# EAGLE design CANBedDualGd (EAGLE 6.4)
DESCRIPTION: microOBD 200 OBD-II Module; HW_REV: 1.4; PCB_REV: C; PCB_SPEC1: Layer Count: 4; PCB_SPEC2: Size: 1.3" x 0.59"; PCB_SPEC3: Finish Thickness: 0.049" - 0.052"; PCB_SPEC4: Copper Weight: 1oz; TITLE: STM1120

## Sheet 1 of 2
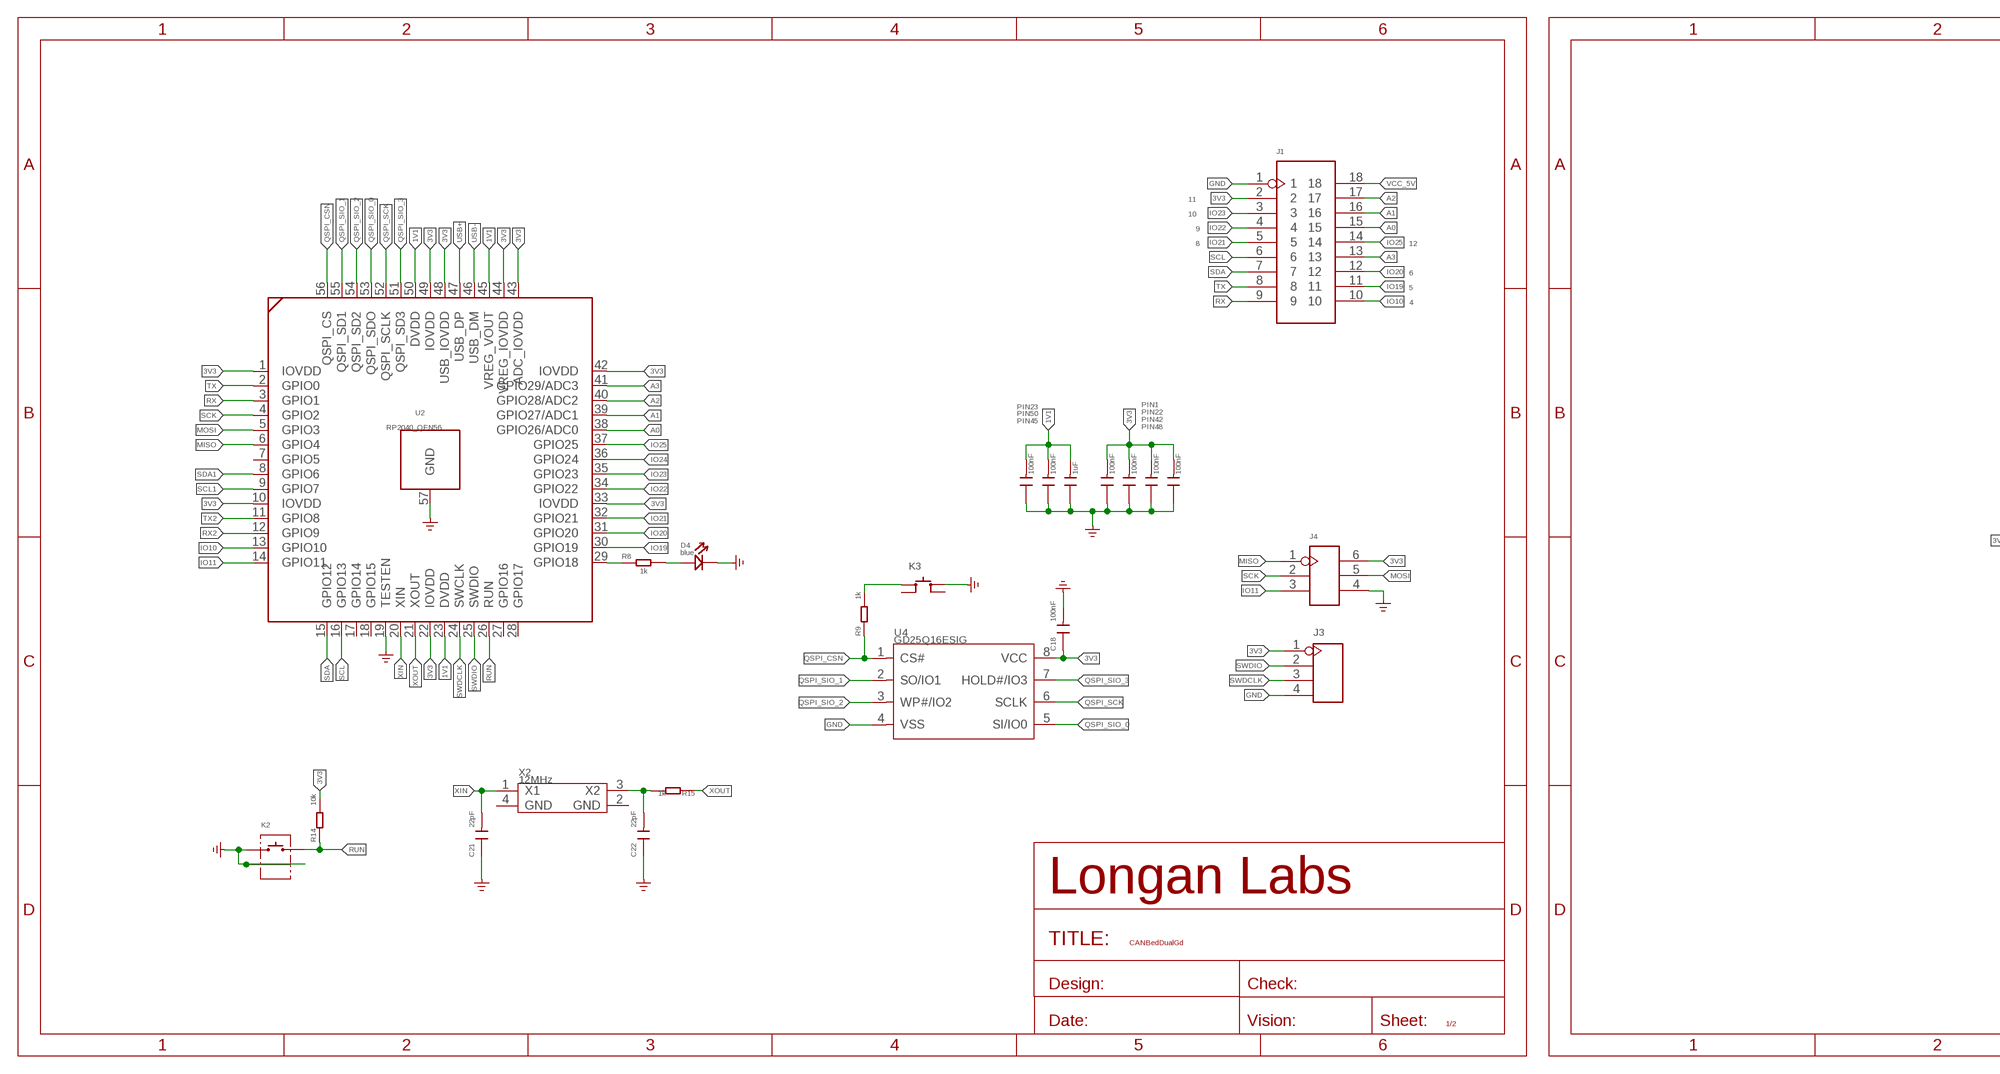
[diagram p0: schematic, sheet 1, part 1 of 2]
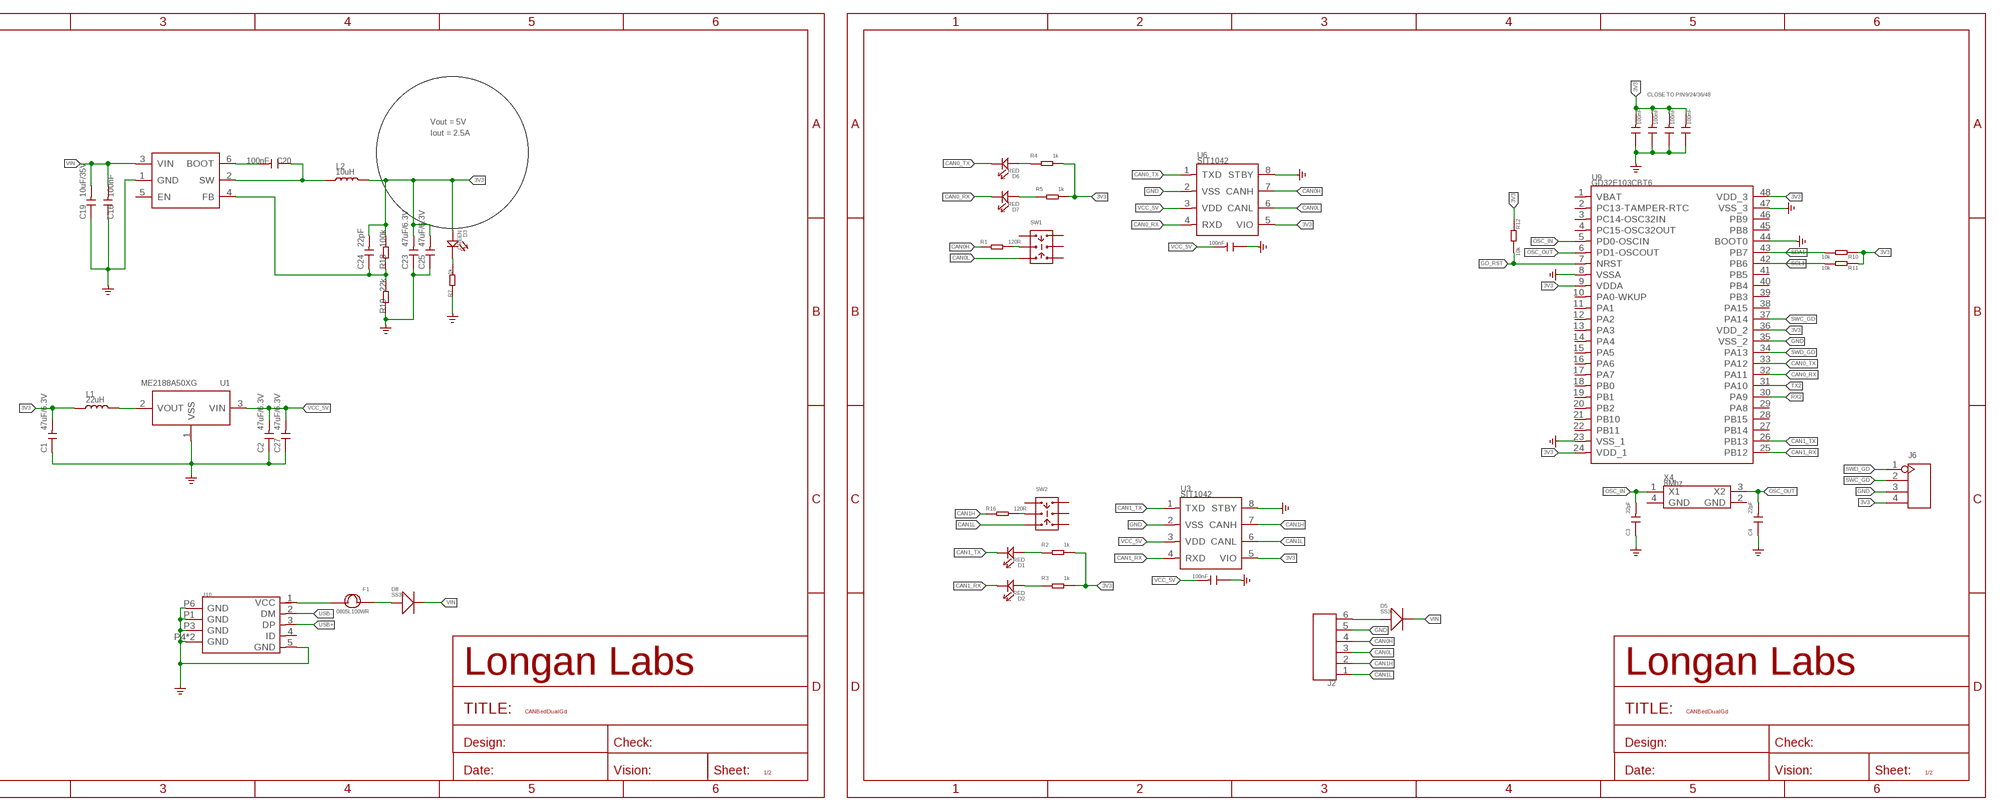
[diagram p1: schematic, sheet 1, part 2 of 2]

### Parts
C1  47uF/6.3V  CAP-0805  [C0805]
C2  47uF/6.3V  CAP-0805  [C0805]
C3  22pF  CAP-0603  [C0603]
C4  22pF  CAP-0603  [C0603]
C5  100nF  CAP-0603  [C0603]
C6  100nF  CAP-0603  [C0603]
C7  100nF  CAP-0603  [C0603]
C8  100nF  CAP-0603  [C0603]
C9  100nF  CAP-0603  [C0603]
C10  100nF  CAP-0603  [C0603]
C11  1uF  CAP-0603  [C0603]
C12  100nF  CAP-0603  [C0603]
C13  100nF  CAP-0603  [C0603]
C14  100nF  CAP-0603  [C0603]
C15  100nF  CAP-0603  [C0603]
C16  100nF  CAP-0603  [C0603]
C17  100nF  CAP-0603  [C0603]
C18  100nF  CAP-0603  [C0603]
C19  10uF/35V  CAP-1206  [C1206]
C20  100nF  CAP-0603  [C0603]
C21  22pF  CAP-0603  [C0603]
C22  22pF  CAP-0603  [C0603]
C23  47uF/6.3V  CAP-0805  [C0805]
C24  22pF  CAP-0603  [C0603]
C25  47uF/6.3V  CAP-0805  [C0805]
C26  100nF  CAP-0603  [C0603]
C27  47uF/6.3V  CAP-0805  [C0805]
D1  RED  LED'0603'  [LED-0603]
D2  RED  LED'0603'  [LED-0603]
D3  GREEN  LED'0603'  [LED-0603]
D4  blue  LED'0603'  [LED-0603]
D5  SS32  DIODE'SMA'  [DO-214AC]
D6  RED  LED'0603'  [LED-0603]
D7  RED  LED'0603'  [LED-0603]
D8  SS32  DIODE'SMA'  [DO-214AC]
F1  0805L100WR  FUSE0805  [F0805]
J1  HEADER-2X9P-2.54  [H2X9-2.54]
J2  SCREW-TERMINAL-6P-3.5  [H6-3.5-21.7X7.0MM]
J3  HEADER-4P-SMD  [H4-SMD-2.54]
J4  HEADER-2X3P-2.54  [H2X3-2.54]
J6  HEADER-4P-SMD  [H4-SMD-2.54]
J10  MICRO-USB5+4P-320010050  [MICRO-USB5+5P-SMD-0.65-7.2X5.06MM]
K2  BUTTON-2+2P  [SW2+2P-7.7X2.75X3.95MM]
K3  BUTTON-4P-4.5X4.5X3.3MM  [SW4-4.5X4.5X3.3MM]
L1  22uH  INDUCTOR-3030  [L3030-TAIYO-YUDEN-NR3012]
L2  10uH  INDUCTOR-SPD3D16-4R7M  [L0420]
R1  120R  RES-0603  [R0603]
R2  1k  RES-0603  [R0603]
R3  1k  RES-0603  [R0603]
R4  1k  RES-0603  [R0603]
R5  1k  RES-0603  [R0603]
R7  1k  RES-0603  [R0603]
R8  1k  RES-0603  [R0603]
R9  1k  RES-0603  [R0603]
R10  10k  RES-0603  [R0603]
R11  10k  RES-0603  [R0603]
R12  10k  RES-0603  [R0603]
R14  10k  RES-0603  [R0603]
R15  1k  RES-0603  [R0603]
R16  120R  RES-0603  [R0603]
R18  100k  RES-0603  [R0603]
R19  22k  RES-0603  [R0603]
SW1  SWITCH-2CH-6P-311010004  [SW6-2.54-9.0X3.5X3.2+2.0MM]
SW2  SWITCH-2CH-6P-311010004  [SW6-2.54-9.0X3.5X3.2+2.0MM]
U1  ME2188A50XG  PMIC-XC6206PMR  [SOT-23]
U2  RP2040_QFN56  [RP2040_QFN56]
U3  SIT1042  TRANSCEIVER-MCP2542  [SOIC8-1.27-5X4MM]
U4  GD25Q16ESIG  FLASH-GD25Q16E  [SOP8-1.27-5.3X5.25X2MM]
U5  PMIC-TPS54302  [SOT-23-6]
U6  SIT1042  TRANSCEIVER-MCP2542  [SOIC8-1.27-5X4MM]
U9  GD32E103CBT6  MCU-GD32E103CBT6  [LQFP48]
X2  12MHz  CRYSTAL-4P-3225  [X4-SMD-3.2X2.5X0.7MM]
X4  8Mhz  CRYSTAL-4P-3225  [X4-SMD-3.2X2.5X0.7MM]

### Nets
1V1: C9.2 C10.2 C11.2 U2.23(DVDD) U2.45(VREG_VOUT) U2.50(DVDD)
3V3: C1.2 C5.2 C6.2 C7.2 C8.2 C12.2 C13.2 C14.2 C15.2 C18.1 C23.2 C24.2 C25.2 D3.+ J1.2 J3.1 J4.6 J6.4 L1.1 L2.2 R2.2 R3.2 R4.2 R5.2 R10.1 R11.1 R12.1 R14.2 R18.2 U2.1(IOVDD) U2.10(IOVDD) U2.22(IOVDD) U2.33(IOVDD) U2.42(IOVDD) U2.43(ADC_IOVDD) U2.44(VREG_IOVDD) U2.48(USB_IOVDD) U2.49(IOVDD) U3.5(VIO) U4.8(VCC) U6.5(VIO) U9.9(VDDA) U9.24(VDD_1) U9.36(VDD_2) U9.48(VDD_3)
A0: J1.15 U2.38(GPIO26/ADC0)
A1: J1.16 U2.39(GPIO27/ADC1)
A2: J1.17 U2.40(GPIO28/ADC2)
A3: J1.13 U2.41(GPIO29/ADC3)
CAN0_RX: D7.- U6.4(RXD) U9.32(PA11)
CAN0_TX: D6.- U6.1(TXD) U9.33(PA12)
CAN0H: J2.4 R1.1 U6.7(CANH)
CAN0L: J2.3 SW1.CH1B U6.6(CANL)
CAN1_RX: D2.- U3.4(RXD) U9.25(PB12)
CAN1_TX: D1.- U3.1(TXD) U9.26(PB13)
CAN1H: J2.2 R16.1 U3.7(CANH)
CAN1L: J2.1 SW2.CH1B U3.6(CANL)
EXT_PWR: F1.2 J10.1(VCC)
GD_RST: R12.2 U9.7(NRST)
GND: C1.1 C2.1 C3.1 C4.1 C5.1 C6.1 C7.1 C8.1 C9.1 C10.1 C11.1 C12.1 C13.1 C14.1 C15.1 C16.1 C17.1 C18.2 C19.1 C21.1 C22.1 C23.1 C25.1 C26.1 C27.1 D4.- J1.1 J2.5 J3.4 J4.4 J6.3 J10.5(GND) J10.P1(GND) J10.P3(GND) J10.P4(GND) J10.P5(GND) J10.P6(GND) K2.1 K2.S1 K2.S2 K3.3(B0) R7.1 R19.1 U1.1(VSS) U2.19(TESTEN) U2.57(GND) U3.2(VSS) U3.8(STBY) U4.4(VSS) U5.1(GND) U6.2(VSS) U6.8(STBY) U9.8(VSSA) U9.23(VSS_1) U9.35(VSS_2) U9.44(BOOT0) U9.47(VSS_3) ; supply symbol labelled GND_POWER
IO10: J1.10 U2.13(GPIO10)
IO11: J4.3 U2.14(GPIO11)
IO19: J1.11 U2.30(GPIO19)
IO20: J1.12 U2.31(GPIO20)
IO21: J1.5 U2.32(GPIO21)
IO22: J1.4 U2.34(GPIO22)
IO23: J1.3 U2.35(GPIO23)
IO24: U2.36(GPIO24)
IO25: J1.14 U2.37(GPIO25)
MISO: J4.1 U2.6(GPIO4)
MOSI: J4.5 U2.5(GPIO3)
N$1: D3.- R7.2
N$2: D1.+ R2.1
N$3: R8.1 U2.29(GPIO18)
N$4: R1.2 SW1.COM1
N$5: R16.2 SW2.COM1
N$6: D4.+ R8.2
N$7: K3.1(A0) R9.2
N$8: C22.2 R15.2 X2.3(X2)
N$9: D6.+ R4.1
N$10: D7.+ R5.1
N$11: D8.1(+) F1.1
N$12: C20.1 L2.1 U5.2(SW)
N$14: C20.2 U5.6(BOOT)
N$15: D2.+ R3.1
N$16: L1.2 U1.2(VOUT)
N$17: D5.1(+) J2.6
N$26: C24.1 R18.1 R19.2 U5.4(FB)
OSC_IN: C3.2 U9.5(PD0-OSCIN) X4.1(X1)
OSC_OUT: C4.2 U9.6(PD1-OSCOUT) X4.3(X2)
QSPI_CSN: R9.1 U2.56(QSPI_CS) U4.1(CS#)
QSPI_SCK: U2.52(QSPI_SCLK) U4.6(SCLK)
QSPI_SIO_0: U2.53(QSPI_SDO) U4.5(SI/IO0)
QSPI_SIO_1: U2.55(QSPI_SD1) U4.2(SO/IO1)
QSPI_SIO_2: U2.54(QSPI_SD2) U4.3(WP#/IO2)
QSPI_SIO_3: U2.51(QSPI_SD3) U4.7(HOLD#/IO3)
RUN: K2.2 R14.1 U2.26(RUN)
RX: J1.9 U2.3(GPIO1)
RX2: U2.12(GPIO9) U9.30(PA9)
SCK: J4.2 U2.4(GPIO2)
SCL: J1.6 U2.16(GPIO13)
SCL1: R11.2 U2.9(GPIO7) U9.42(PB6)
SDA: J1.7 U2.15(GPIO12)
SDA1: R10.2 U2.8(GPIO6) U9.43(PB7)
SWC_GD: J6.2 U9.37(PA14)
SWD_GD: J6.1 U9.34(PA13)
SWDCLK: J3.3 U2.24(SWCLK)
SWDIO: J3.2 U2.25(SWDIO)
TX: J1.8 U2.2(GPIO0)
TX2: U2.11(GPIO8) U9.31(PA10)
USB+: J10.3(DP) U2.47(USB_DP)
USB-: J10.2(DM) U2.46(USB_DM)
VCC_5V: C2.2 C17.2 C26.2 C27.2 J1.18 U1.3(VIN) U3.3(VDD) U6.3(VDD)
VIN: C16.2 C19.2 D5.2(-) D8.2(-) U5.3(VIN)
XIN: C21.2 U2.20(XIN) X2.1(X1)
XOUT: R15.1 U2.21(XOUT)
Unconnected: J10.4(ID) K3.2(A1) K3.4(B1) SW1.CH1A SW1.CH2A SW1.CH2B SW1.COM2 SW2.CH1A SW2.CH2A SW2.CH2B SW2.COM2 U2.7(GPIO5) U2.17(GPIO14) U2.18(GPIO15) U2.27(GPIO16) U2.28(GPIO17) U5.5(EN) U9.1(VBAT) U9.2(PC13-TAMPER-RTC) U9.3(PC14-OSC32IN) U9.4(PC15-OSC32OUT) U9.10(PA0-WKUP) U9.11(PA1) U9.12(PA2) U9.13(PA3) U9.14(PA4) U9.15(PA5) U9.16(PA6) U9.17(PA7) U9.18(PB0) U9.19(PB1) U9.20(PB2) U9.21(PB10) U9.22(PB11) U9.27(PB14) U9.28(PB15) U9.29(PA8) U9.38(PA15) U9.39(PB3) U9.40(PB4) U9.41(PB5) U9.45(PB8) U9.46(PB9) X2.2(GND) X2.4(GND) X4.2(GND) X4.4(GND)

### Notes on the sheet
- CLOSE TO PIN9/24/36/48
- Vout = 5V
- Iout = 2.5A
- 11
- 10
- 9
- 8 | 12
- 6
- 5
- 4
- PIN23
- PIN1
- PIN50
- PIN22
- PIN45
- PIN42
- PIN48

## Sheet 2 of 2

## Library data of the parts
C1-C27 = Discrete-new:CAP: Ceramic Capacitors
D1-D4 D6 D7 = Discrete-new:LED
D5 D8 = Discrete-new:DIODE*
F1 = Discrete-small:FUSE
J1 = Connector-new:HEADER-2X9P
J2 = Connector-new:SCREW-TERMINAL-6P: 320110059
J3 J6 = Connector-new:HEADER-4P
J4 = Connector-new:HEADER-2X3P
J10 = Connector-new:MICRO-USB5+4P: 320010137:MICRO USB B型DIP 沉板0.7无卷边 -ST-USB-01H2 320010000:MICRO USB 5F CCHT 6.45(0.8X0.9) -ST-USB-001G 320010050:USB-MC-001-05 320010025:MICRO USB 5S AB TYPE DIP7.2
K2 = Connector-new:BUTTON-2+2P
K3 = Switch:BUTTON-4P
L1 L2 = Discrete-new:INDUCTOR
R1-R5 R7-R12 R14-R16 R18 R19 = Discrete-new:RES
SW1 SW2 = Switch:SWITCH-2CH-6P
U1 = IC-new:PMIC-XC6206P: LOW ESR Cap.Compatible Positive Voltage Regulators
U2 = RP2040_QFN56:RP2040_QFN56
U3 U6 = untitled:TRANSCEIVER-MCP2542
U4 = Longan-IC:FLASH-GD25Q16E
U5 = IC-new:PMIC-TPS54302
U9 = Longan-IC:MCU-GD32E103CBT6
X2 X4 = Discrete-new:CRYSTAL-4P

## Net classes
3 usbvcc: width 0.152 mm, drill 0.152 mm, clearance 0.152 mm

## Board
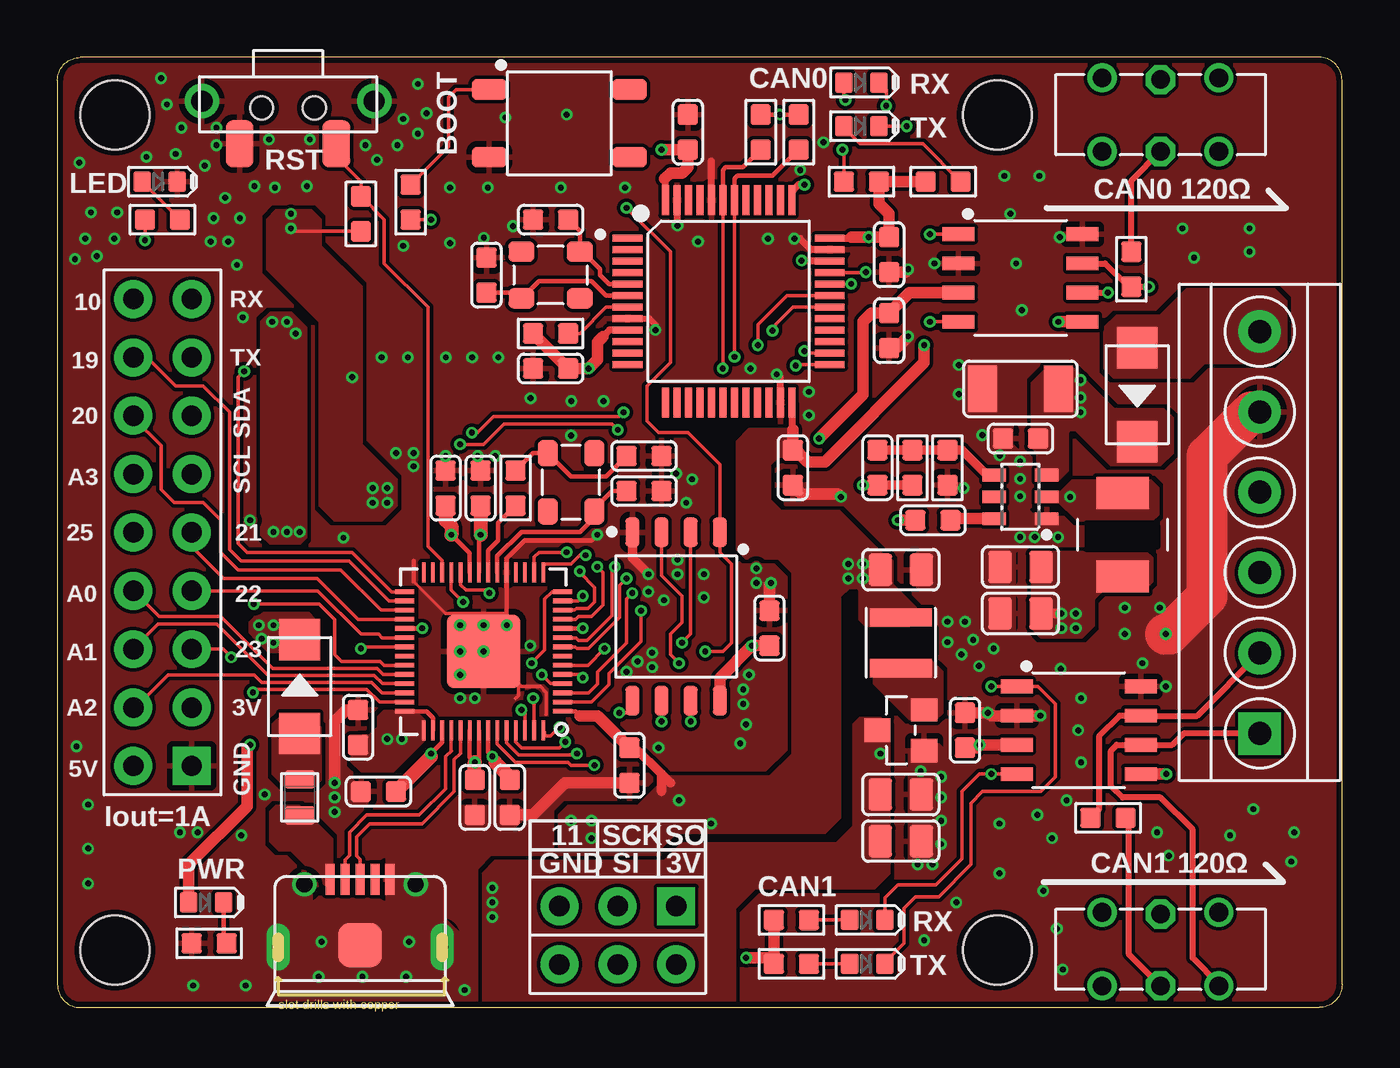
[diagram p2: board, top side]
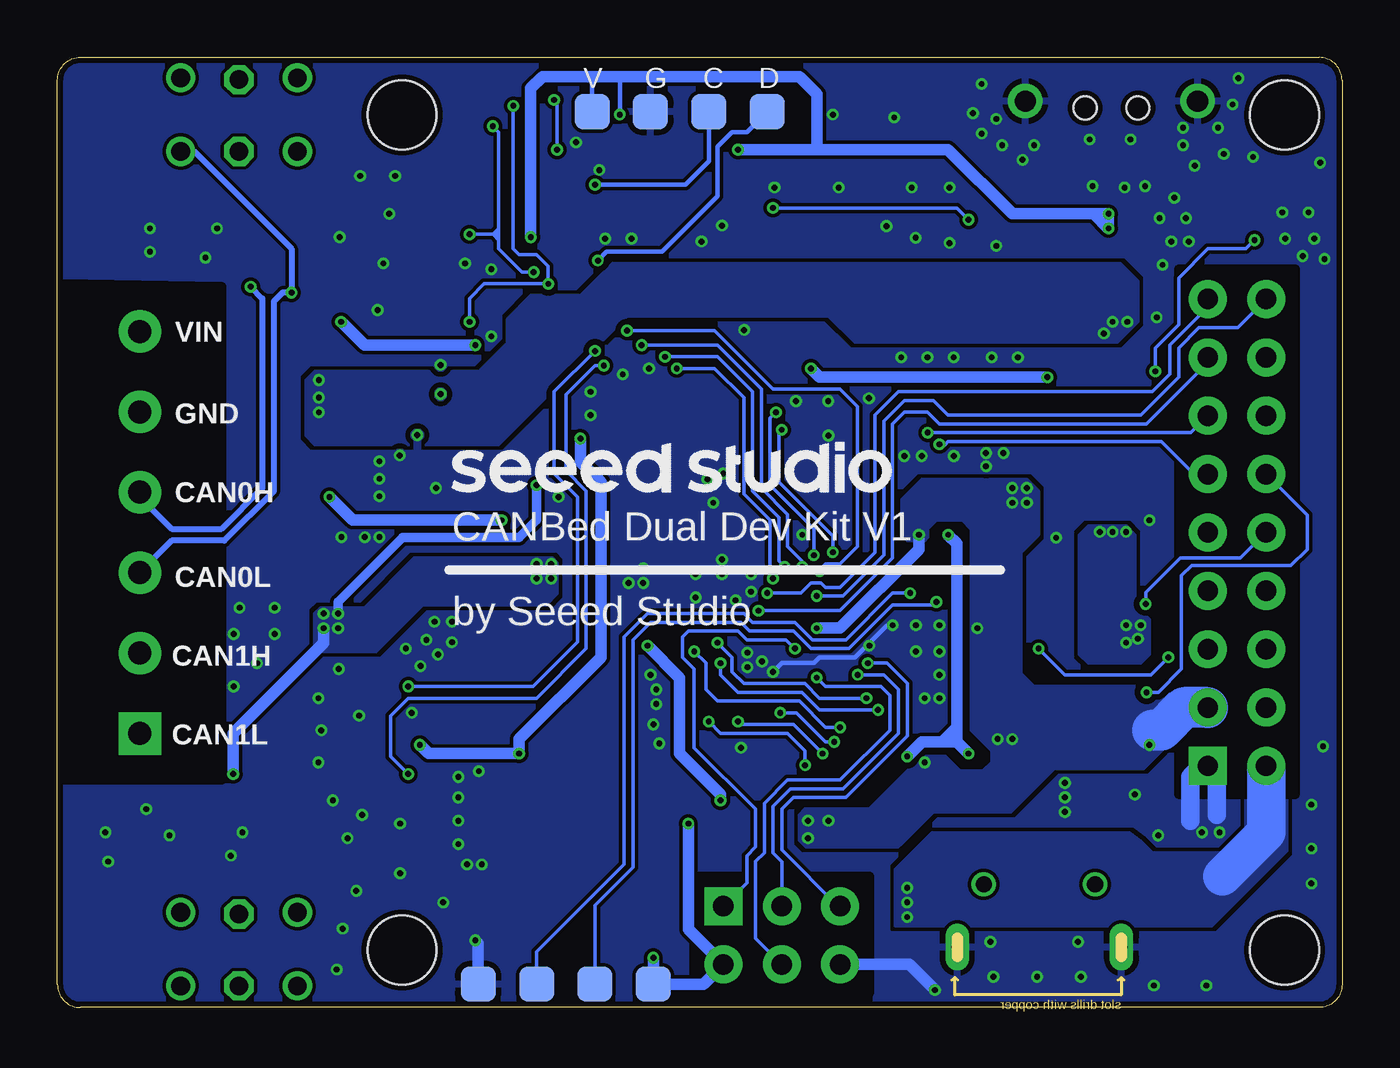
[diagram p3: board, bottom side, seen from below]

Size 55.91 x 41.35 mm. Coordinates in mm from the lower left corner, seen from the top.
Outline: 1,0 54.91,0 arc90 55.91,1 55.91,40.35 arc84 55.01,41.35 1,41.35 arc90 0,40.35 0,1 arc90 1,0
Copper layers (1*16): Top 0.035mm / dielectric 1.5mm / Bottom 0.035mm
Design rules "SeeedStudio_2layer_DRU_no_angle_20140221 *": minimum track width 1mil, minimum drill 10mil, track to track 6mil, track to pad 6mil, pad to pad 6mil, via to via 6mil, smd to smd 0mil, copper to edge 10mil, drill to drill 10mil, minimum pad ring 4mil, minimum via ring 4mil, stop-mask expansion 2mil, vias tented up to drill 25mil, thermal gap 10mil
Holes 3 mm at 2.5,38.85 2.5,2.5 40.91,38.85 40.91,2.5
tRestrict: area 44.8,20.1 to 47.9,21; area 38,15.4 to 38.2,16.5
bRestrict: area 2,9.3 to 7.1,32.1; area 48.8,9.9 to 55.9,31.5; area 20.6,0.6 to 28.2,5.7

### Footprints (pad centres in the part's own frame; a part is rotated, then mirrored left to right if it is on the bottom)
C0805 = smd 1.016 x 1.397: 1 -0.889,0; 2 0.889,0
C0603 = smd 0.889 x 0.889: 1 -0.762,0; 2 0.762,0
C1206 = smd 1.27 x 2.032: 1 -1.651,0; 2 1.651,0
LED-0603 = smd 0.762 x 0.889: + 0.762,0; - -0.762,0
DO-214AC = smd 1.8 x 1.77: 1 -2.042,0; 2 2.042,0
F0805 = smd 0.819 x 1.27: 1 -0.79,0; 2 0.79,0
H2X9-2.54 = drill 0.889 pad 1.651 square: 1 -1.27,10.16 | drill 0.889 pad 1.651: 2 -1.27,7.62; 3 -1.27,5.08; 4 -1.27,2.54; 5 -1.27,0; 6 -1.27,-2.54; 7 -1.27,-5.08; 8 -1.27,-7.62; 9 -1.27,-10.16; 10 1.27,-10.16; 11 1.27,-7.62; 12 1.27,-5.08; 13 1.27,-2.54; 14 1.27,0; 15 1.27,2.54; 16 1.27,5.08; 17 1.27,7.62; 18 1.27,10.16
H6-3.5-21.7X7.0MM = drill 1 pad 1.85 square: 1 -8.75,0 | drill 1 pad 1.85: 2 -5.25,0; 3 -1.75,0; 4 1.75,0; 5 5.25,0; 6 8.75,0
H4-SMD-2.54 = smd 1.524 x 1.524: 1 0,5.08; 2 0,2.54; 3 0,0; 4 0,-2.54
H2X3-2.54 = drill 0.889 pad 1.651 square: 1 -1.27,2.54 | drill 0.889 pad 1.651: 2 -1.27,0; 3 -1.27,-2.54; 4 1.27,-2.54; 5 1.27,0; 6 1.27,2.54
MICRO-USB5+5P-SMD-0.65-7.2X5.06MM = smd 0.4 x 1.35: 1 -1.3,2.875; 2 -0.65,2.875; 3 0,2.875; 4 0.65,2.875; 5 1.3,2.875 | smd 1.9 x 1.9: P1 0,0 | drill 0.508 pad 1.016 long: P3 -3.575,-0.08; P4 3.575,-0.08 | drill 0.7: P5 -2.425,2.65; P6 2.425,2.65
SW2+2P-7.7X2.75X3.95MM = smd 1.2 x 2.032: 1 -2.1,-0.254; 2 2.1,-0.254 | drill 0.924 pad 1.5: S1 -3.75,1.6; S2 3.75,1.6 | hole 1: -1.15,1.3; 1.15,1.3
SW4-4.5X4.5X3.3MM = smd 1.5 x 0.9: 1 -3.05,1.475; 2 3.05,1.475; 3 -3.05,-1.475; 4 3.05,-1.475
L3030-TAIYO-YUDEN-NR3012 = smd 0.8 x 2.7: 1 -1.1,0; 2 1.1,0
L0420 = smd 1.4 x 2.3: 1 -1.815,0; 2 1.815,0
R0603 = smd 0.889 x 0.889: 1 -0.762,0; 2 0.762,0
SW6-2.54-9.0X3.5X3.2+2.0MM = drill 0.813 pad 1.27: CH1A -2.54,-1.6; CH1B 2.54,-1.6; CH2A -2.54,1.6; CH2B 2.54,1.6 | drill 0.813 pad 1.27 octagon: COM1 0,-1.6; COM2 0,1.524
SOT-23 = smd 1.016 x 1.143: 1 -0.889,-1.016; 2 0.889,-1.016; 3 0,1.016
RP2040_QFN56 = smd 0.875 x 0.2: 1 -3.438,2.6; 2 -3.438,2.2; 3 -3.438,1.8; 4 -3.438,1.4; 5 -3.438,1; 6 -3.438,0.6; 7 -3.438,0.2; 8 -3.438,-0.2; 9 -3.438,-0.6; 10 -3.438,-1; 11 -3.438,-1.4; 12 -3.438,-1.8; 13 -3.438,-2.2; 14 -3.438,-2.6; 29 3.438,-2.6; 30 3.438,-2.2; 31 3.438,-1.8; 32 3.438,-1.4; 33 3.438,-1; 34 3.438,-0.6; 35 3.438,-0.2; 36 3.438,0.2; 37 3.438,0.6; 38 3.438,1; 39 3.438,1.4; 40 3.438,1.8; 41 3.438,2.2; 42 3.438,2.6 | smd 0.2 x 0.875: 15 -2.6,-3.438; 16 -2.2,-3.438; 17 -1.8,-3.438; 18 -1.4,-3.438; 19 -1,-3.438; 20 -0.6,-3.438; 21 -0.2,-3.438; 22 0.2,-3.438; 23 0.6,-3.438; 24 1,-3.438; 25 1.4,-3.438; 26 1.8,-3.438; 27 2.2,-3.438; 28 2.6,-3.438; 43 2.6,3.438; 44 2.2,3.438; 45 1.8,3.438; 46 1.4,3.438; 47 1,3.438; 48 0.6,3.438; 49 0.2,3.438; 50 -0.2,3.438; 51 -0.6,3.438; 52 -1,3.438; 53 -1.4,3.438; 54 -1.8,3.438; 55 -2.2,3.438; 56 -2.6,3.438 | smd 3.2 x 3.2: 57 0,0
SOIC8-1.27-5X4MM = smd 0.6 x 1.4: 1 -1.905,-2.7; 2 -0.635,-2.7; 3 0.635,-2.7; 4 1.905,-2.7; 5 1.905,2.7; 6 0.635,2.7; 7 -0.635,2.7; 8 -1.905,2.7
SOP8-1.27-5.3X5.25X2MM = smd 0.6 x 1.27: 1 -1.905,-3.665; 2 -0.635,-3.665; 3 0.635,-3.665; 4 1.905,-3.665; 5 1.905,3.665; 6 0.635,3.665; 7 -0.635,3.665; 8 -1.905,3.665
SOT-23-6 = smd 0.55 x 1.016: 1 -0.95,-1.143; 2 0,-1.143; 3 0.95,-1.143; 4 0.95,1.143; 5 0,1.143; 6 -0.95,1.143
LQFP48 = smd 1.3 x 0.3: 1 -4.4,2.75; 2 -4.4,2.25; 3 -4.4,1.75; 4 -4.4,1.25; 5 -4.4,0.75; 6 -4.4,0.25; 7 -4.4,-0.25; 8 -4.4,-0.75; 9 -4.4,-1.25; 10 -4.4,-1.75; 11 -4.4,-2.25; 12 -4.4,-2.75; 25 4.4,-2.75; 26 4.4,-2.25; 27 4.4,-1.75; 28 4.4,-1.25; 29 4.4,-0.75; 30 4.4,-0.25; 31 4.4,0.25; 32 4.4,0.75; 33 4.4,1.25; 34 4.4,1.75; 35 4.4,2.25; 36 4.4,2.75 | smd 0.3 x 1.3: 13 -2.75,-4.4; 14 -2.25,-4.4; 15 -1.75,-4.4; 16 -1.25,-4.4; 17 -0.75,-4.4; 18 -0.25,-4.4; 19 0.25,-4.4; 20 0.75,-4.4; 21 1.25,-4.4; 22 1.75,-4.4; 23 2.25,-4.4; 24 2.75,-4.4; 37 2.75,4.4; 38 2.25,4.4; 39 1.75,4.4; 40 1.25,4.4; 41 0.75,4.4; 42 0.25,4.4; 43 -0.25,4.4; 44 -0.75,4.4; 45 -1.25,4.4; 46 -1.75,4.4; 47 -2.25,4.4; 48 -2.75,4.4
X4-SMD-3.2X2.5X0.7MM = smd 1.143 x 0.889: 1 -1.27,-1.016; 2 1.27,-1.016; 3 1.27,1.016; 4 -1.27,1.016

### Placement (x,y rotation side)
C1  36.7,19.05 180 top
C2  36.7,9.27 180 top
C3  21.46,34.29 0 top
C4  18.67,31.88 270 top
C5  21.46,27.81 0 top
C6  32,23.5 90 top
C7  36.2,32.77 90 top
C8  27.43,38.1 270 top
C9  16.89,22.61 270 top
C10  19.68,9.14 90 top
C11  13.97,9.4 0 top
C12  24.89,10.54 90 top
C13  18.41,22.61 270 top
C14  13.08,12.19 270 top
C15  18.16,9.14 90 top
C16  41.91,24.77 0 top
C17  36.2,29.46 90 top
C18  30.99,16.51 90 top
C19  41.91,26.92 0 top
C20  38.1,21.21 0 top
C21  25.53,22.48 180 top
C22  25.53,24 180 top
C23  41.91,19.18 0 top
C24  35.69,23.5 270 top
C25  41.91,17.14 0 top
C26  39.5,12.06 270 top
C27  36.7,7.24 180 top
D1  35.24,1.91 180 top
D2  35.24,3.81 180 top
D3  6.48,4.57 180 top
D4  4.45,35.94 180 top
D5  46.99,26.67 270 top
D6  34.99,38.35 180 top
D7  34.99,40.26 180 top
D8  10.54,13.97 90 top
F1  10.54,9.14 270 top
J1  4.57,20.68 180 top
J2  52.32,20.68 90 top
J3  35.05,1.02 270 bottom
J4  24.38,3.14 270 top
J6  30.1,38.99 270 bottom
J10  13.17,2.71 0 top
K2  10.03,37.85 0 top
K3  21.84,38.48 0 top
L1  36.7,15.88 270 top
L2  46.35,20.57 270 top
R1  46.74,32.13 90 top
R2  31.94,1.91 180 top
R3  31.94,3.81 180 top
R4  38.54,35.94 180 top
R5  34.99,35.94 0 top
R7  6.6,2.79 0 top
R8  4.57,34.29 0 top
R9  15.37,35.05 90 top
R10  30.61,38.1 270 top
R11  32.26,38.1 270 top
R12  21.46,29.34 0 top
R14  13.21,34.54 270 top
R15  19.94,22.61 90 top
R16  45.72,8.26 0 top
R18  37.21,23.5 270 top
R19  38.73,23.5 90 top
SW1  48.01,38.86 0 top
SW2  48.01,2.54 0 top
U1  36.7,12.06 90 top
U2  18.54,15.49 180 top
U3  44.45,12.06 270 top
U4  26.92,17.02 180 top
U5  41.91,22.23 90 top
U6  41.91,31.75 270 top
U9  29.21,30.73 0 top
U$23  [LOGO-SEEED-NEW-2_1X19.1MM]  38.73,22.48 0 bottom
X2  22.35,22.86 90 top
X4  21.46,31.88 180 top

### Tracks (layer width: path | path; a pad name or v marks a point on that pad's centre or on a via)
1V1  (via drill 0.25 pad 0.51)
  Top 0.203: U2.23 17.94,19.78 v17.14,20.57 | U2.45 16.74,11.54 v16.26,11.05 16.26,10.92 | U2.50 18.74,11.1 v18.92,10.92 18.92,10.79 19.05,10.67
  Top 0.61: C9.2 16.89,21.21 17.14,20.95 v17.14,20.57 | C10.2 19.68,10.03 19.05,10.67 | 16.26,10.92 C11.2
  Bottom 0.508: v16.26,11.05 16.76,11.56 | 16.76,11.56 17.4,11.56 | 17.4,11.56 18.29,11.56 v18.92,10.92 | 16.76,11.56 16.76,12.19 | 16.76,12.19 16.76,20.19 v17.14,20.57 | 16.76,12.19 17.4,11.56
3V3  (via drill 0.25 pad 0.51)
  Top 0.152: R14.2 10.29,33.78 v10.16,33.91
  Top 0.203: U2.33 15.86,16.49 v15.88,16.51 | U2.22 18.34,20.5 v18.41,20.57 | U2.44 16.34,12.61 16.06,12.89 U2.42 | U2.48 17.94,10.89 v18.16,10.67 18.34,10.85 U2.49 | U2.1 22.54,12.89 22.73,12.7 | U2.10 22.84,16.49 v22.86,16.51 | R10.1 v31.43,38.86 R11.1
  Top 0.305: U9.9 24.02,29.48 23.75,29.21 | U9.48 26.46,36.02 26.42,36.07 | U9.36 34.5,33.48 34.54,33.53 | U9.24 31.96,25.19 32,25.15
  Top 0.406: 26.67,9.78 26.29,10.16 | 26.29,10.16 25.15,11.3 C12.2 | R18.2 C24.2 v35.05,22.73 | C25.2 v43.69,17.14 | 26.29,10.16 26.29,9.4
  Top 0.508: R3.2 R2.2 30.92,2.16 v29.97,2.16 | 22.73,12.7 23.5,12.7 C12.2 | C18.1 v30.23,15.75 28.83,14.35 U4.8 | R4.2 R5.2 35.75,34.99 36.2,34.54 C7.2 v35.31,33.53 34.54,33.53 | 23.75,29.21 23.5,28.96 23.5,28.19 v23.11,27.81 C5.2 R12.1 | v26.29,37.34 C8.2 27.43,36.58 27.18,36.32 26.67,36.32 26.42,36.07 | 32,25.15 32,24.38 | 32,24.38 C6.2 | D3.+ 5.71,6.22 8.26,8.76 8.26,11.3 v8.38,11.43 | 32,24.38 32.64,23.75 33.4,23.75 37.72,28.07 v37.72,28.83 | U6.5 v43.56,29.84 | U3.5 v48.26,10.16
  Top 0.61: C13.2 v18.41,20.57 | C15.2 v18.16,10.67
  Bottom 0.203: v31.43,38.86 31.43,40.51 | J6.4 32.64,40.39 32.77,40.51
  Bottom 0.406: v35.05,22.73 35.05,21.21 35.81,20.45 40.89,20.45 43.69,17.65 v43.69,17.14
  Bottom 0.508: v28.45,8 28.45,3.4 J4.6 27.78,1.02 J3.1 v29.97,2.16 | v30.23,15.75 28.83,14.35 28.83,11.05 27.05,9.27 v27.05,9.02 | v18.41,20.57 18.41,19.94 21.84,16.51 v22.86,16.51 | v26.29,37.34 22.86,37.34 | 22.86,37.34 17.14,37.34 14.35,34.54 10.79,34.54 | 10.79,34.54 v10.16,34.54 v10.16,33.91 10.79,34.54 | v37.72,28.83 42.55,28.83 v43.56,29.84 | v48.26,10.16 48.26,11.94 44.32,15.88 v44.32,16.51 | v12.83,27.43 22.73,27.43 v23.11,27.81 | v35.31,33.53 35.31,40.01 34.8,40.51 32.77,40.51 31.43,40.51 23.62,40.51 22.86,39.75 22.86,37.34
  Bottom 1.778: J1.2 6.88,13.05 7.87,12.06 8.26,12.06
  other vias: 14.35,11.68 14.99,11.68 22.35,8.13 23.24,8.13 23.24,7.37 14.35,22.61 13.72,22.61 13.72,21.97 14.35,21.97 44.32,17.14 43.69,16.51 35.05,19.3 34.42,19.3 35.05,18.67 34.42,18.67
  pour Top (isolate 0.254, no thermals): 14.61,10.29 13.23,10.29 12.82,10.69 12.82,11.39 13.25,11.81 13.59,11.81 13.97,12.19 13.97,12.64 14.22,12.89 15.56,12.89 15.94,12.51 15.94,11.62
  pour Bottom (isolate 0.254, no thermals): 17.65,21.21 16.53,21.21 16.13,20.81 16.13,12.06 15.24,11.18 15.24,10.67 15.62,10.29 16.64,10.29 17.27,10.92 18.29,10.92 20.57,8.64 23.37,8.64 23.62,8.38 23.62,7.27 23.34,6.99 19.33,6.99 19.18,7.11 17.78,8.51 14.42,8.51 12.51,10.41 8.64,10.41 6.99,12.06 5.46,12.06 5.08,12.45 5.08,13.59 5.46,13.97 13.4,13.97 13.97,14.54 13.97,19.81 13.21,20.57 13.21,22.48 13.72,22.99 18.29,22.99 19.18,22.1 19.18,20.57 18.92,20.32 18.16,20.32 18.03,20.45 18.03,20.83
  pour Top (isolate 0.254, no thermals): 36.2,18.29 36.2,19.43 34.04,21.59 31.5,21.59 30.99,22.1 30.99,23.62 31.37,24 31.88,24 32.13,24.26 32.13,24.77 31.75,25.15 30.1,25.15 29.59,24.64 29.59,19.94 29.97,19.56 31.37,19.56 32,18.92 32,11.02 31.01,10.03 26.54,10.03 25.27,8.76 22.23,8.76 21.84,8.38 21.84,6.99 26.29,6.99 26.92,7.62 33.4,7.62 34.04,8.26 34.04,17.89 34.44,18.29
  pour Top (isolate 0.254, no thermals): 14.73,21.84 14.73,22.99 13.21,24.51 13.21,31.37 11.43,33.15 11.43,34.29 11.05,34.67 9.53,34.67 9.14,34.29 9.14,32.13 11.43,29.84 11.43,21.84 12.06,21.21 14.1,21.21
  pour Top (isolate 0.254, no thermals): 47.37,19.81 42.8,19.81 42.42,19.43 42.42,16.51 42.8,16.13 44.58,16.13 45.09,16.64 45.09,17.78 45.59,18.29 47.37,18.29 47.62,18.54 47.62,19.56
  pour Bottom (isolate 0.254, no thermals): 40.01,17.53 34.65,17.53 34.15,18.02 34.15,19.34 34.37,19.56 40.39,19.56 42.55,17.4 44.45,17.4 44.7,17.14 44.7,15.75 44.45,15.49 42.04,15.49
  pour Top (isolate 0.254, rank 2, no thermals): 37.08,16.64 35.18,16.64 34.92,16.89 34.92,18.16 34.67,18.41 34.67,19.43 34.92,19.68 36.07,19.68 36.32,19.43 36.32,18.41 37.34,17.4 37.34,16.89
A0
  Top 0.152: J1.15 4.42,17.02 7.11,17.02 9.37,14.76 13.92,14.76 14.18,14.49 U2.38
A1
  Top 0.152: J1.16 3.3,15.62 4.38,16.7 6.92,16.7 9.17,14.45 13.79,14.45 14.15,14.09 U2.39
A2
  Top 0.152: J1.17 3.4,13.05 4.83,14.48 8.56,14.48 8.89,14.15 13.66,14.15 14.12,13.69 U2.40
A3  (via drill 0.25 pad 0.51)
  Top 0.152: U2.41 14.01,13.29 13.46,13.84 8.64,13.84 v8.51,13.72
  Bottom 0.152: J1.13 1.52,21.44 1.52,19.94 2.22,19.24 6.54,19.24 6.99,18.8 6.99,14.73 8,13.72 v8.51,13.72
CAN0_RX  (via drill 0.25 pad 0.51)
  Top 0.152: U9.32 34.53,31.48 v34.54,31.5 | U6.4 v37.97,29.84 | v36.07,39.24 36.07,39.94 D7.-
  Bottom 0.152: v36.07,39.24 36.07,33.02 35.81,32.77 35.05,32.77 34.54,32.26 v34.54,31.5 37.34,31.5 37.97,30.86 v37.97,29.84
CAN0_TX  (via drill 0.25 pad 0.51)
  Top 0.152: v36.96,38.35 D6.- | U9.33 35.16,31.98 v35.18,32 | U6.1 v37.97,33.66
  Bottom 0.152: 36.7,33.4 36.7,33.02 35.69,32 v35.18,32 | 36.7,33.4 36.7,33.66 | 36.7,33.66 36.7,33.91 | 36.7,33.91 36.7,38.1 v36.96,38.35 | v37.97,33.66 36.96,33.66 | 36.96,33.66 36.7,33.66 | 36.7,33.91 36.96,33.66 | 36.96,33.66 36.7,33.4
CAN0H  (via drill 0.25 pad 0.51)
  Top 0.254: v47.5,31.37 R1.1 46.61,31.37 45.59,32.38 U6.7
  Bottom 0.254: v47.5,31.37 46.99,30.86 46.99,22.61 48.77,20.83 50.93,20.83 52.32,22.23 J2.4
CAN0L  (via drill 0.25 pad 0.51)
  Top 0.254: U6.6 v45.72,31.11
  Bottom 0.254: J2.3 50.93,20.32 48.64,20.32 46.48,22.48 46.48,30.73 46.1,31.11 v45.72,31.11 45.72,33.02 49.96,37.26 SW1.CH1B
CAN1_RX  (via drill 0.25 pad 0.51)
  Top 0.152: D2.- 36.01,4.76 36.58,5.33 38.23,5.33 39.37,6.48 39.37,9.4 40.13,10.16 v40.64,10.16 U3.4 | U9.25 32.17,27.98 v32.13,27.94
  Bottom 0.152: v32.13,27.94 32.51,27.94 33.78,26.67 33.78,23.37 32.89,22.48 32.89,15.62 35.06,13.46 40.64,13.46 41.4,12.7 41.4,10.92 v40.64,10.16
CAN1_TX  (via drill 0.25 pad 0.51)
  Top 0.152: D1.- 36.01,1.97 36.83,2.79 36.83,4.32 37.34,4.83 38.35,4.83 39.75,6.22 39.75,8.89 40.26,9.4 42.8,9.4 43.43,10.03 43.43,13.21 42.67,13.97 U3.1 v40.64,13.97 | U9.26 32.6,28.48 v32.51,28.57
  Bottom 0.152: v40.64,13.97 35.21,13.97 33.27,15.9 33.27,22.23 34.29,23.24 34.29,26.8 v32.51,28.57
CAN1H
  Top 0.254: R16.1 45.34,8.64 45.34,11.81 46.23,12.7 U3.7 49.6,12.7 J2.2
CAN1L
  Top 0.254: SW2.CH1B 50.55,1.02 49.4,2.16 49.4,7.75 48.01,9.14 46.35,9.14 45.85,9.65 45.85,11.18 46.1,11.43 U3.6 48.51,11.43 49.01,11.93 J2.1
EXT_PWR
  pour Top (isolate 0.254, no thermals): 11.81,5.21 10.16,6.86 9.65,6.86 9.27,7.24 9.27,8.51 9.53,8.76 10.52,8.76 11.94,7.34 11.94,5.33
GD_RST
  Top 0.152: U9.7 23.88,30.48 22.73,29.34 R12.2
GND  (via drill 0.25 pad 0.51)
  Top 0.127: 16.89,17.15 15.49,18.54 | 19.68,16.64 v19.56,16.64
  Top 0.152: 19.54,17.15 16.89,17.15 | 18.54,15.37 18.8,15.37 20.07,14.1 | 20.07,14.1 20.19,13.97 21.02,13.97 21.27,13.72 21.27,12.76 | 20.07,14.1 20.07,13.59 19.94,13.46
  Top 0.203: U2.57 18.54,15.37 19.54,16.37 19.54,17.15 U2.19 19.54,19.54 20.32,20.32 23.24,20.32 v23.5,20.57 | 15.49,18.54 15.49,19.43 | 25.02,20.32 25.08,20.26
  Top 0.254: U9.8 25.77,29.98 26.04,29.72 26.04,29.5 v26.02,29.49
  Top 0.305: U9.47 26.96,34.06 v26.99,34.04 | U9.23 31.46,27.4 v31.3,27.56 | U9.35 32.8,32.98 32.32,33.47 v32.07,33.47 | U9.44 28.46,36.84
  Top 0.406: 25.08,20.26 25.02,20.19 U4.4 25.02,19.56 v25.72,18.86
  Top 0.508: C18.2 30.99,18.41 v31.05,18.48 | C12.1 22.1,9.78 20.7,8.38 C10.1 | C17.1 36.51,28.7 v37.02,29.21 | C7.1 36.89,32 v37.02,32.13 | C6.1 32.38,22.35 33.97,22.35 v34.1,22.23 | C14.1 12.57,12.95 12.06,12.45 v12.06,9.78 | C26.1 v40.49,12.83 40.51,12.83 40.64,12.7 U3.2 v42.77,12.7
  Top 1.778: v48.23,16.26 48.39,16.26 50.04,17.91 50.04,24 51.96,25.93 J2.5
  Bottom 0.152: v19.56,16.64 19.81,16.64
  Bottom 0.203: 19.81,16.64 21.21,15.24 22.73,15.24 22.99,14.99 24.38,14.99 v24.77,14.61
  Bottom 0.508: J4.4 18.83,1.87 v17.72,0.76 | J3.4 37.59,2.79 v37.72,2.92
  Bottom 0.813: 6.6,8.13 6.6,10.03 6.12,10.52 J1.1 5.84,10.16 5.71,10.16 5.46,9.91 5.46,8.38
  other vias: 15.05,38.67 5.4,38.29 5.14,37.15 3.87,37.02 1.46,34.61 1.33,6.92 1.33,5.4 11.49,2.86 15.3,2.86 5.91,0.95 8.19,0.95 26.16,11.3 29.72,11.49 43.5,3.43 43.75,1.65 30.42,18.48 30.42,19.11 30.1,14.48 29.84,13.84 29.84,13.21 15.49,24.13 15.49,23.56 16.89,24 18.29,24 8.57,35.75 18.54,15.49 18.54,16.64 17.53,16.64 17.53,15.49 17.53,14.48 17.53,13.46 18.16,13.46 25.25,15.06 9.46,35.69 1.33,8.83 25.72,18.1 20.57,15.75 26.99,18.86 28.13,17.84 14.8,37.53 13.4,37.53 15.68,38.04 6.92,38.29 6.92,37.53 9.21,37.78 10.99,37.78 14.73,24.13 19.05,24 8.38,21.21 12.45,20.45 6.67,33.34 7.43,33.34 0.95,36.77 2.48,33.46 0.76,32.58 0.83,11.37 26.92,23.24 27.62,22.99 27.37,21.97 22.35,24.89 26.99,19.49 28.13,18.86 16.07,38.93 15.68,40.2 33.34,37.66 29.97,12.32 39.12,4.57 11.37,1.33 13.27,1.33 15.18,1.33 18.55,33.5 19.82,34.01 20.59,26.52 22.36,26.39 23.76,26.39 30.16,27.81 18.73,35.69 21.91,35.69 24.7,35.69 19.49,38.73 22.16,38.86 32.32,36.45 38.16,32.38 43.62,33.53 41.97,30.35 41.72,32.38 41.47,34.54 42.74,36.2 17.08,33.27 15.05,33.15 7.81,32.32 8.06,30.04 19.19,28.3 16.9,28.3 15.25,28.3 14.11,28.3 30.92,33.46 27.88,33.34 38.46,7.11 38.46,8.13 38.46,9.14 38.46,10.03 48.23,13.97 44.55,13.46 43.66,14.73 40.11,14.86 39.85,16 40.74,15.62 39.34,15.37 44.42,12.06 44.55,10.67 43.92,9.02 42.65,8.38 41,8 41,5.84 42.9,5.08 43.28,7.37 51.03,7.49 53.82,7.62 52.04,8.64 53.7,6.35 47.85,7.62 48.36,6.6 47.22,14.99 46.46,16.26 46.46,17.4 47.98,17.4 39.43,22.61 41.9,22.25 41.9,23.01 41.9,23.77 41.01,24.03 39.23,27.97 39.23,26.7 40.25,24.92 39.5,16.79 38.73,16.79 38.73,15.9 32.7,26.8 32.7,25.78 43.55,20.47 42.53,20.47 41.9,20.47 12.06,9.14 12.06,8.51 9.02,9.27 5.33,7.62 6.1,7.62 8,7.49 37.57,10.29 37.44,6.22 38.07,6.22 17.08,35.69 18.05,28.3 41.21,36.2 48.96,33.91 51.88,33.91 51.88,32.89 49.47,32.64 25.88,15.44 25.88,14.81 26.39,17.73 7.3,35.24 7.94,34.35 10.86,35.75 13.91,36.89 6.79,34.35 1.21,33.46 2.6,34.61 1.71,32.7 4.51,40.45 4.76,39.31 6.41,36.64
  pour Top (isolate 0.254, no thermals): 25.91,10.92 30.34,10.92 31.24,11.82 31.24,14.58 30.84,14.99 30.54,14.99 29.97,14.42 29.97,13.01 29.16,12.19 25.91,12.19
  pour Top (isolate 0.127, rank 6): -0.64,41.91 56.52,41.91 56.52,-0.64 -0.64,-0.64
  pour Bottom (isolate 0.127, rank 6): -0.64,41.91 56.52,41.91 56.52,-0.64 2.54,-0.64 2.54,-1.27 -0.64,-1.27
  pour Top (isolate 0.254, no thermals): 20.07,8.76 17.27,8.76 15.88,7.37 14.75,7.37 14.35,6.96 14.35,4.45 13.97,4.06 11.43,4.06 11.05,4.45 11.05,5.21 10.67,5.59 9.14,5.59 8.51,4.95 8.51,2.41 7.75,1.65 7.75,0.51 8.26,0 17.53,0 17.91,0.38 17.91,2.79 16.64,4.06 16.64,4.7 17.14,5.21 20.45,8.38
  pour Top (isolate 0.254, no thermals): 41.15,14.61 39.62,14.61 38.61,15.62 38.61,17.14 37.34,18.41 37.34,19.68 37.72,20.07 40.26,20.07 41.15,20.95 41.15,22.99 39.37,24.77 38.73,24.77 38.23,25.27 38.23,28.07 39.24,29.08 40.89,29.08 41.53,28.45 41.53,24.51 42.16,23.88 42.16,21.72 42.42,21.46 43.43,21.46 44.07,20.83 44.07,20.45 43.94,20.32 42.16,20.32 41.66,19.81 41.66,15.11
  pour Top (isolate 0.254, no thermals): 13.34,9.65 13.08,9.65 12.57,10.16 12.32,10.16 11.94,9.78 11.94,8.38 12.06,8.26 12.83,8.26 13.46,8.89 13.46,9.53
  pour Top (isolate 0.254, no thermals): 38.35,11.43 37.34,11.43 37.08,11.18 37.08,6.22 37.34,5.97 38.23,5.97 38.73,6.48 38.73,11.05
IO10  (via drill 0.25 pad 0.51)
  Top 0.152: U2.13 22.65,17.69 v22.86,17.91
  Bottom 0.152: J1.10 4.55,29.59 6.22,29.59 7.11,28.7 7.11,27.43 8.76,25.78 17.14,25.78 17.78,26.42 19.05,26.42 19.94,25.53 19.94,19.68 21.72,17.91 v22.86,17.91
IO11  (via drill 0.25 pad 0.51)
  Top 0.152: v20.64,14.99 21.21,15.56 21.21,17.78 21.52,18.09 U2.14
  Bottom 0.152: v20.64,14.99 19.81,14.99 18.92,14.1 18.92,11.81 21.59,9.14 23.88,9.14 24.38,8.64 24.38,6.86 21.94,4.41 J4.3
IO19
  Top 0.152: U2.30 14.44,17.69 12.7,19.43 8,19.43 7.49,19.94 7.49,25.91 6.35,27.05 5.14,27.05 3.9,28.3 J1.11
IO20
  Top 0.152: U2.31 14.07,17.29 12.32,19.05 7.87,19.05 7.11,19.81 7.11,21.21 6.35,21.97 5.08,21.97 4.51,22.54 4.51,24.45 3.3,25.65 J1.12
IO21
  Top 0.152: U2.32 13.08,16.89 11.3,18.67 7.24,18.67 5.84,20.07 J1.5
IO22
  Top 0.152: J1.4 11.33,18.14 13.21,16.26 13.97,16.26 14.13,16.09 U2.34
IO23  (via drill 0.25 pad 0.51)
  Top 0.152: U2.35 13.28,15.69 v13.21,15.62 | J1.3 7.2,15.6 v7.56,15.24
  Bottom 0.152: v13.21,15.62 12.06,14.48 8.32,14.48 v7.56,15.24
IO25  (via drill 0.25 pad 0.51)
  Top 0.152: U2.37 14.21,14.89 14.04,15.06 12.37,15.06 12.06,15.37 12.06,16.89 11.39,17.56 v8.54,17.56
  Bottom 0.152: J1.14 4.42,19.56 7.05,19.56 8.54,18.06 v8.54,17.56
MISO  (via drill 0.25 pad 0.51)
  Top 0.152: U2.6 23.09,14.89 v23.81,15.62
  Bottom 0.152: v23.81,15.62 24.19,16 25.91,16 26.29,16.38 28.45,16.38 28.7,16.13 28.7,15.24 28.19,14.73 28.19,11.3 25.53,8.64 25.53,6.99 25.91,6.6 25.91,5.43 J4.1
MOSI  (via drill 0.25 pad 0.51)
  Top 0.152: U2.5 22.72,14.49 v22.86,14.35
  Bottom 0.152: J4.5 25.53,3.02 25.53,6.35 25.15,6.73 25.15,8.89 24.13,9.91 21.84,9.91 19.68,12.06 19.68,13.59 20.07,13.97 22.48,13.97 v22.86,14.35
N$1
  Top 0.203: D3.- 7.24,2.92 R7.2
N$2
  Top 0.152: D1.+ R2.1
N$3  (via drill 0.25 pad 0.51)
  Top 0.152: U2.29 14.54,18.09 12.83,19.81 8.26,19.81 7.87,20.19 7.87,27.43 v8.13,27.69 | v3.81,33.4 R8.1
  Bottom 0.152: v8.13,27.69 8.13,28.7 7.11,29.72 7.11,31.75 5.84,33.02 4.19,33.02 v3.81,33.4
N$4
  Top 0.254: R1.2 46.74,35.99 SW1.COM1
N$5
  Top 0.254: SW2.COM1 46.61,2.34 46.61,8.13 R16.2
N$6
  Top 0.152: R8.2 D4.+
N$7
  Top 0.152: K3.1 17.35,39.96 17.02,39.62 17.02,37.47 R9.2
N$8
  Top 0.203: R15.2 20.7,24.13 X2.3 22.35,23.11 23.88,23.11 C22.2
N$9
  Top 0.152: D6.+ 34.23,38.29 34.92,37.59 37.66,37.59 R4.1
N$10  (via drill 0.25 pad 0.51)
  Top 0.152: D7.+ 34.23,39.56 v34.29,39.5 | R5.1 34.23,37.27 v34.16,37.34
  Bottom 0.152: v34.16,37.34 34.16,39.37 v34.29,39.5
N$11
  pour Top (isolate 0.254, no thermals): 10.92,12.7 9.78,12.7 9.4,12.32 9.4,10.16 9.91,9.65 11.18,9.65 11.43,9.91 11.43,12.19
N$12  (via drill 0.25 pad 0.51)
  Top 0.508: C20.1 v36.58,21.21
  Bottom 0.508: v36.58,21.21 43.05,21.21 v44.07,22.23
  pour Top (isolate 0.254, no thermals): 42.93,22.4 43.66,22.4 44.17,22.91 47.57,22.91 47.88,22.61 47.88,21.46 47.62,21.21 44.4,21.21 43.51,22.1 42.95,22.1 42.85,22.2 42.85,22.33
N$14
  Top 0.508: U5.6 38.93,21.27 C20.2
N$15
  Top 0.152: D2.+ R3.1
N$16
  pour Top (isolate 0.254, no thermals): 38.48,12.83 38.48,14.61 37.97,15.11 35.94,15.11 35.56,14.73 35.56,14.1 37.08,12.57 38.23,12.57
N$17
  pour Top (isolate 0.254, no thermals): 52.96,31.24 49.15,31.24 48.01,30.1 46.1,30.1 45.59,29.59 45.59,27.81 45.97,27.43 49.28,27.43 49.91,28.07 52.83,28.07 53.47,28.7 53.47,30.73
N$26
  Top 0.406: U5.4 40.45,23.18 39.37,24.26 R19.2 R18.1 C24.1
OSC_IN
  Top 0.203: U9.5 24.02,31.48 23.62,31.88 23.62,32.13 22.86,32.89 X4.1 22.73,33.78 C3.2
OSC_OUT
  Top 0.203: U9.6 23.88,30.98 23.24,31.62 20.95,31.62 X4.3 19.94,31.11 C4.2
QSPI_CSN  (via drill 0.25 pad 0.51)
  Top 0.152: 21.14,11.88 U2.56 21.21,11.99 21.21,11.81 21.46,11.81 v21.84,12.19 | v24.77,34.8 26.67,32.89 26.67,28.07 25.65,27.05 25.65,25.53 26.16,25.02 27.43,25.02 28.83,23.62 U4.1 28.83,19.81 29.34,19.3 29.34,15.88 28.96,15.49 v28.19,15.49 | v16.26,34.29 R9.1
  Bottom 0.152: v24.77,34.8 16.76,34.8 v16.26,34.29 | v28.19,15.49 27.69,14.99 27.69,13.84 27.18,13.34 23.62,13.34 22.48,12.19 v21.84,12.19
QSPI_SCK  (via drill 0.25 pad 0.51)
  Top 0.152: U2.52 19.54,11.51 20.07,10.99 22.54,10.99 v22.61,11.05 | U4.6 v26.29,12.45
  Bottom 0.152: v22.61,11.05 23.88,12.32 26.16,12.32 v26.29,12.45
QSPI_SIO_0  (via drill 0.25 pad 0.51)
  Top 0.152: U2.53 19.94,11.55 20.19,11.3 21.84,11.3 v22.1,11.56 | U4.5 25.02,13.08 24.77,12.83 v24.45,12.83
  Bottom 0.152: v22.1,11.56 22.48,11.56 23.75,12.83 v24.45,12.83
QSPI_SIO_1  (via drill 0.25 pad 0.51)
  Top 0.152: U2.55 20.74,13.42 v20.7,13.46 | U4.2 27.56,16.26 v27.18,15.88
  Bottom 0.152: v20.7,13.46 22.73,13.46 23.37,14.1 26.04,14.1 26.54,14.61 26.54,15.24 v27.18,15.88
QSPI_SIO_2  (via drill 0.25 pad 0.51)
  Top 0.152: U4.3 26.29,18.8 27.18,17.91 27.18,16.76 26.67,16.26 26.67,15.37 v27.05,14.99 | v20.19,12.95 20.34,12.8 U2.54
  Bottom 0.152: v20.19,12.95 22.73,12.95 23.5,13.72 26.29,13.72 27.05,14.48 v27.05,14.99
QSPI_SIO_3  (via drill 0.25 pad 0.51)
  Top 0.152: U2.51 19.14,11.46 19.94,10.67 22.23,10.67 22.35,10.54 v23.37,10.54 | U4.7 v27.56,12.45
  Bottom 0.152: v23.37,10.54 23.37,11.18 24.13,11.94 27.05,11.94 v27.56,12.45
RUN
  Top 0.152: U2.26 16.74,19.45 16.13,20.07 16.13,30.48 14.22,32.38 14.22,34.29 R14.1 13.21,35.95 12.13,37.02 K2.2
RX  (via drill 0.25 pad 0.51)
  Top 0.152: U2.3 23.11,13.69 23.5,14.07 23.5,14.61 24.77,15.88 24.77,17.78 v25.02,18.03
  Bottom 0.152: J1.9 5.84,30.48 7.49,28.83 7.49,27.56 8.26,26.8 19.3,26.8 20.32,25.78 20.32,19.81 21.84,18.29 22.48,18.29 22.67,18.48 23.11,18.48 23.56,18.03 v25.02,18.03
RX2  (via drill 0.25 pad 0.51)
  Top 0.152: v22.73,18.99 22.73,18.92 23.37,18.29 23.37,17.65 23.09,17.37 22.58,17.37 22.5,17.29 U2.12 | U9.30 32.01,30.48 31.11,29.59 v31.11,29.46
  Bottom 0.152: v22.73,18.99 22.73,19.05 22.48,19.3 21.84,19.3 21.08,20.07 21.08,26.16 21.84,26.92 24.77,26.92 27.3,29.46 v31.11,29.46
SCK  (via drill 0.25 pad 0.51)
  Top 0.152: U2.4 21.47,14.09 v21.08,14.48
  Bottom 0.152: J4.2 24.38,6.35 24.77,6.73 24.77,8.76 24,9.53 21.72,9.53 19.3,11.94 19.3,13.84 19.94,14.48 v21.08,14.48
SCL  (via drill 0.25 pad 0.51)
  Top 0.152: v17.53,24.51 18.54,24.51 19.43,25.4 24.13,25.4 v24.38,25.15 | U2.16 20.74,19.6 20.95,19.81 v22.16,19.81
  Bottom 0.152: v17.53,24.51 17.27,24.51 17.14,24.64 7.87,24.64 6.45,23.21 J1.6 | v22.16,19.81 22.16,20.51 24.51,22.86 24.51,25.02 v24.38,25.15
SCL1  (via drill 0.25 pad 0.51)
  Top 0.152: U2.9 22.57,16.09 22.68,15.98 23.04,15.98 24.13,17.07 24.13,19.05 v24.26,19.18 | U9.42 v29.46,28.32
  Top 0.203: U9.42 29.46,36.06 29.59,36.2 31.11,36.2 R11.2
  Bottom 0.152: v24.26,19.18 24.51,19.43 24.51,21.34 25.65,22.48 25.65,26.8 27.18,28.32 v29.46,28.32
SDA  (via drill 0.25 pad 0.51)
  Top 0.152: v18.03,25.02 18.29,25.02 18.99,25.72 24.45,25.72 v24.64,25.91 | v22.99,19.68 22.73,19.68 22.35,19.3 21.21,19.3 21.14,19.24 U2.15
  Bottom 0.152: v18.03,25.02 6.58,25.02 J1.7 | v22.99,19.68 22.99,20.83 24.89,22.73 24.89,25.65 v24.64,25.91
SDA1  (via drill 0.25 pad 0.51)
  Top 0.152: U2.8 22.53,15.69 22.61,15.62 23.11,15.62 24.46,16.97 24.46,18.36 v24.77,18.67 | U9.43 v28.96,27.82 v28.96,27.81
  Top 0.203: U9.43 28.96,36.45 29.08,36.58 29.84,36.58 R10.2
  Bottom 0.152: v24.77,18.67 24.89,18.8 24.89,21.21 26.04,22.35 26.04,26.54 27.3,27.81 v28.96,27.81
SWC_GD  (via drill 0.25 pad 0.51)
  Top 0.305: U9.37 31.96,35.52 32.26,35.81 v32.51,35.81
  Bottom 0.203: J6.2 27.56,36.83 28.57,35.81 v32.51,35.81
SWD_GD  (via drill 0.25 pad 0.51)
  Top 0.305: U9.34 32.41,32.48 v32.38,32.51
  Bottom 0.203: v32.38,32.51 32,32.89 29.59,32.89 27.18,35.31 27.18,37.47 26.54,38.1 25.91,38.1 J6.1
SWDCLK  (via drill 0.25 pad 0.51)
  Top 0.152: U2.24 17.54,18.4 17.78,18.16 18.67,18.16 v18.8,18.03
  Bottom 0.152: v18.8,18.03 19.56,18.03 21.59,16 23.04,16 23.8,16.76 25.65,16.76 26.04,17.14 30.23,17.14 31.24,16.13 31.24,6.22 35.05,2.41 J3.3
SWDIO  (via drill 0.25 pad 0.51)
  Top 0.152: U2.25 17.14,18.16 v17.65,17.65
  Bottom 0.152: v17.65,17.65 17.78,17.53 19.56,17.53 21.46,15.62 23.11,15.62 23.88,16.38 25.78,16.38 26.16,16.76 30.1,16.76 30.86,16 30.86,6.1 32.51,4.45 J3.2
TX  (via drill 0.25 pad 0.51)
  Top 0.152: U2.2 23.24,13.29 24,14.06 24,14.54 25.4,15.94 v25.4,17.27
  Bottom 0.152: J1.8 5.84,28.07 8.51,25.4 17.53,25.4 18.03,25.91 19.05,25.91 19.56,25.4 19.56,19.56 21.84,17.27 v25.4,17.27
TX2  (via drill 0.25 pad 0.51)
  Top 0.152: U2.11 22.55,16.89 22.67,17.02 23.24,17.02 23.75,17.53 23.75,18.92 v23.5,19.18 | v30.48,28.83 30.48,29.72 31.75,30.98 U9.31
  Bottom 0.152: v23.5,19.18 23.5,19.43 24.13,20.07 24.13,21.46 25.27,22.61 25.27,26.92 27.18,28.83 v30.48,28.83
USB+
  Top 0.152: J10.3 13.17,6.45 13.02,6.6 13.02,7.43 13.59,8 15.88,8 17.27,9.4 17.27,10.79 17.54,11.06 U2.47
USB-
  Top 0.152: J10.2 12.52,6.42 12.71,6.62 12.71,7.63 13.46,8.38 15.75,8.38 16.89,9.53 16.89,10.92 17.14,11.18 U2.46
VCC_5V  (via drill 0.25 pad 0.51)
  Top 0.508: U6.3 37.08,31.11 C17.2 35.43,30.23 35.05,29.84 35.05,26.67 v33.15,24.77 | U3.3 v40.13,11.43 40.01,11.3 C26.2
  Bottom 0.508: v40.13,11.43 39.75,11.05 v35.81,11.05 35.81,11.68 32.26,15.24 32.26,22.86 33.15,23.75 v33.15,24.77
  Bottom 1.676: J1.18 3.3,7.62 5.21,5.71
  other vias: 18.92,5.21 18.92,3.94 18.92,4.57
  pour Bottom (isolate 0.127, no thermals): 2.92,11.18 3.81,11.18 4.19,10.79 4.19,7.49 4.95,6.73 8.26,6.73 8.76,7.24 9.27,7.62 10.06,7.61 17.82,7.62 19.43,6.01 19.43,3.56 5.68,3.56 2.41,6.82 2.41,10.67
  pour Top (isolate 0.127, no thermals): 19.05,6.35 26.42,6.35 27.18,7.11 33.91,7.11 34.67,7.87 34.67,12.32 34.92,12.57 35.81,12.57 36.2,12.19 36.2,5.84 35.56,5.21 30.36,5.21 29.46,4.31 29.46,0 18.54,0 18.54,5.84
VIN  (via drill 0.25 pad 0.51)
  other vias: 9.4,15.88 9.4,16.64 8.76,16.64 8.89,16.05 9.4,20.7 9.98,20.7 10.54,20.7 9.35,29.84 9.98,29.84 10.36,29.34 44.53,27.3 44.53,26.54 44.53,25.91
  pour Top (isolate 0.254, no thermals): 43.56,22.99 43.05,22.99 42.67,23.37 42.67,24.13 42.42,24.38 42.42,27.18 43.05,27.81 44.2,27.81 45.97,26.04 48.13,26.04 48.51,25.65 48.51,24.13 48.01,23.62 45.85,23.62 44.32,25.15 44.07,25.15 43.94,25.02 43.94,23.37
  pour Top (isolate 0.254, no thermals): 10.92,17.14 8.76,17.14 8.38,16.76 8.38,16.26 9.14,15.49 10.92,15.49 11.18,15.75 11.18,16.89
  pour Bottom (isolate 0.254, no thermals): 11.05,14.99 8.76,14.99 8.38,15.37 8.38,16.89 9.02,17.53 9.02,20.57 9.4,20.95 11.05,20.95 11.43,20.57 11.43,15.37
  pour Top (isolate 0.254, no thermals): 10.54,20.19 9.27,20.19 8.89,20.57 8.89,29.84 9.27,30.23 10.16,30.23 10.79,29.59 10.79,20.45
  pour Bottom (isolate 0.254, no thermals): 44.7,27.69 37.55,27.69 36.32,28.91 36.32,29.97 35.31,30.99 33.15,30.99 31.75,32.38 9.65,32.38 8.89,31.62 8.89,29.84 9.78,28.96 21.21,28.96 22.35,30.1 31.11,30.1 36.7,24.51 44.7,24.51 45.09,24.89 45.09,27.3
XIN
  Top 0.203: U2.20 19.14,19.65 20.19,20.7 22.73,20.7 23.37,21.34 X2.1 23.37,21.72 24.13,22.48 C21.2
XOUT
  Top 0.203: U2.21 18.74,19.89 19.18,20.32 19.18,21.08 R15.1

### Text on the board
tPlace: CAN0 | RX | TX | RST | BOOT | CAN0 120Ω | LED | 10 | RX | 19 | TX | 20 | SDA | A3 | SCL | 21 | 25 | A0 | 22 | 23 | A1 | A2 | 3V | GND | 5V | Iout=1A | 11 | SCK | SO | CAN1 120Ω | PWR | GND | SI | 3V | CAN1 | RX | TX
bPlace: D | C | G | V | VIN | GND | CAN0H | CANBed Dual Dev Kit V1 | CAN0L | by Seeed Studio | CAN1H | CAN1L